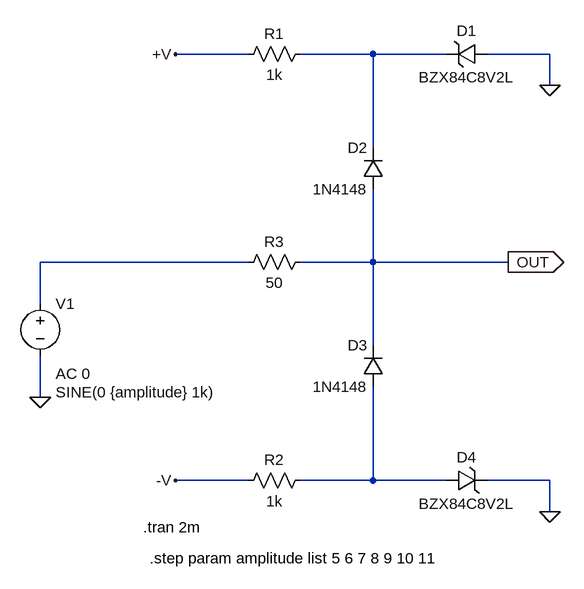
[diagram p0: schematic diode protection.asc]
diode protection.asc, the LTspice schematic file:
Version 4
SHEET 1 880 680
WIRE -176 -368 -288 -368
WIRE 16 -368 -96 -368
WIRE 128 -368 16 -368
WIRE 288 -368 192 -368
WIRE 288 -320 288 -368
WIRE 16 -224 16 -368
WIRE -176 -48 -496 -48
WIRE 16 -48 16 -160
WIRE 16 -48 -96 -48
WIRE 224 -48 16 -48
WIRE -496 16 -496 -48
WIRE 16 80 16 -48
WIRE -496 160 -496 96
WIRE -176 288 -288 288
WIRE 16 288 16 144
WIRE 16 288 -96 288
WIRE 128 288 16 288
WIRE 288 288 192 288
WIRE 288 336 288 288
FLAG -496 160 0
FLAG -288 -368 +V
FLAG 288 -320 0
FLAG -288 288 -V
FLAG 288 336 0
FLAG 224 -48 OUT
IOPIN 224 -48 Out
SYMBOL diode 32 -160 R180
WINDOW 0 24 64 Left 2
WINDOW 3 24 0 Left 2
SYMATTR InstName D2
SYMATTR Value 1N4148
SYMBOL diode 32 144 R180
WINDOW 0 24 64 Left 2
WINDOW 3 24 0 Left 2
SYMATTR InstName D3
SYMATTR Value 1N4148
SYMBOL voltage -496 0 R0
WINDOW 3 24 152 Left 2
WINDOW 123 24 124 Left 2
WINDOW 39 0 0 Left 0
SYMATTR InstName V1
SYMATTR Value SINE(0 {amplitude} 1k)
SYMATTR Value2 AC 0
SYMBOL res -80 -384 R90
WINDOW 0 0 56 VBottom 2
WINDOW 3 32 56 VTop 2
SYMATTR InstName R1
SYMATTR Value 1k
SYMATTR SpiceLine tol=1
SYMBOL zener 192 -384 R90
WINDOW 0 -4 32 VBottom 2
WINDOW 3 36 32 VTop 2
SYMATTR InstName D1
SYMATTR Value BZX84C8V2L
SYMBOL res -80 272 R90
WINDOW 0 0 56 VBottom 2
WINDOW 3 32 56 VTop 2
SYMATTR InstName R2
SYMATTR Value 1k
SYMATTR SpiceLine tol=1
SYMBOL zener 128 304 R270
WINDOW 0 36 32 VTop 2
WINDOW 3 -4 32 VBottom 2
SYMATTR InstName D4
SYMATTR Value BZX84C8V2L
SYMBOL res -80 -64 R90
WINDOW 0 0 56 VBottom 2
WINDOW 3 32 56 VTop 2
SYMATTR InstName R3
SYMATTR Value 50
TEXT -338 360 Left 2 !.tran 2m
TEXT -328 408 Left 2 !.step param amplitude list 5 6 7 8 9 10 11

The netlist it stands for:
* diode protection.asc
D2 OUT N001 1N4148
D3 N003 OUT 1N4148
V1 N002 0 SINE(0 {amplitude} 1k) AC 0
R1 N001 +V 1k tol=1
D1 0 N001 BZX84C8V2L
R2 N003 -V 1k tol=1
D4 N003 0 BZX84C8V2L
R3 OUT N002 50
.model D D
.lib standard.dio
.tran 2m
.step param amplitude list 5 6 7 8 9 10 11
.backanno
.end